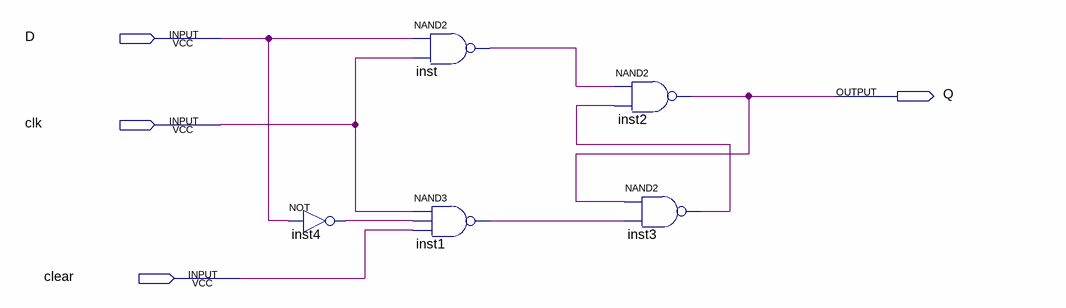
[diagram p0: schematic sheet]
// Quartus schematic d-latch.bdf as structural Verilog: 5 symbols, 4 pins
module \d-latch  (
  input  D,
  input  clk,
  input  clear,
  output Q
);

  wire inst1_out, inst3_out, inst4_out, inst_out;

  not inst4 (inst4_out, D);
  nand inst (inst_out, D, clk);
  nand inst1 (inst1_out, clk, inst4_out, clear);
  nand inst2 (Q, inst_out, inst3_out);
  nand inst3 (inst3_out, Q, inst1_out);
endmodule
